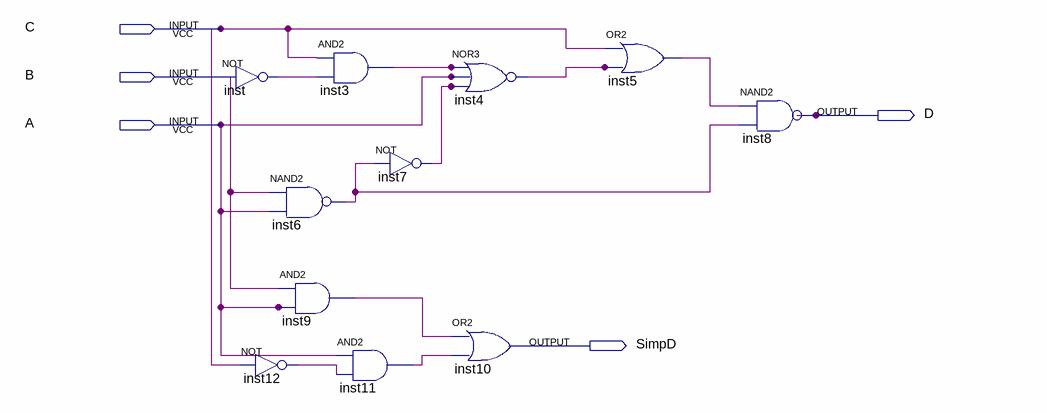
[diagram p0: schematic sheet]
// Quartus schematic part2.bdf as structural Verilog: 11 symbols, 5 pins
module part2 (
  input  C,
  input  B,
  input  A,
  output D,
  output SimpD
);

  wire inst3_out, inst4_out, inst5_out, inst6_out, inst7_out, inst9_out, inst11_out, inst12_out, inst_out;

  not inst (inst_out, B);
  not inst12 (inst12_out, C);
  and inst3 (inst3_out, C, inst_out);
  nand inst6 (inst6_out, B, A);
  and inst9 (inst9_out, B, A);
  and inst11 (inst11_out, A, inst12_out);
  not inst7 (inst7_out, inst6_out);
  nor inst4 (inst4_out, inst3_out, A, inst7_out);
  or inst10 (SimpD, inst9_out, inst11_out);
  or inst5 (inst5_out, C, inst4_out);
  nand inst8 (D, inst5_out, inst6_out);
endmodule
